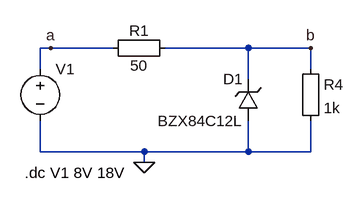
[diagram p0: schematic Z-VAR.asc]
Z-VAR.asc, the LTspice schematic file:
Version 4
SHEET 1 880 680
WIRE 272 -256 256 -256
WIRE 368 -256 272 -256
WIRE 576 -256 448 -256
WIRE 672 -256 576 -256
WIRE 256 -224 256 -256
WIRE 672 -224 672 -256
WIRE 576 -208 576 -256
WIRE 256 -96 256 -144
WIRE 416 -96 256 -96
WIRE 576 -96 576 -144
WIRE 576 -96 416 -96
WIRE 672 -96 672 -144
WIRE 672 -96 576 -96
WIRE 416 -80 416 -96
FLAG 416 -80 0
FLAG 672 -256 b
FLAG 272 -256 a
SYMBOL Misc\\EuropeanResistor 656 -240 R0
SYMATTR InstName R4
SYMATTR Value 1k
SYMBOL zener 592 -144 R180
WINDOW 0 24 64 Left 2
WINDOW 3 24 0 Left 2
SYMATTR InstName D1
SYMATTR Value BZX84C12L
SYMBOL Misc\\EuropeanResistor 464 -272 R90
WINDOW 0 5 56 VBottom 2
WINDOW 3 27 56 VTop 2
SYMATTR InstName R1
SYMATTR Value 50
SYMBOL voltage 256 -240 R0
WINDOW 123 0 0 Left 2
WINDOW 39 0 0 Left 2
SYMATTR InstName V1
SYMATTR Value ""
TEXT 232 -64 Left 2 !.dc V1 8V 18V

The netlist it stands for:
* Z-VAR.asc
R4 b 0 1k
D1 0 b BZX84C12L
R1 b a 50
V1 a 0
.model D D
.lib standard.dio
.dc V1 8V 18V
.backanno
.end